# EAGLE schematic RPi Controller (EAGLE 6.5.0)
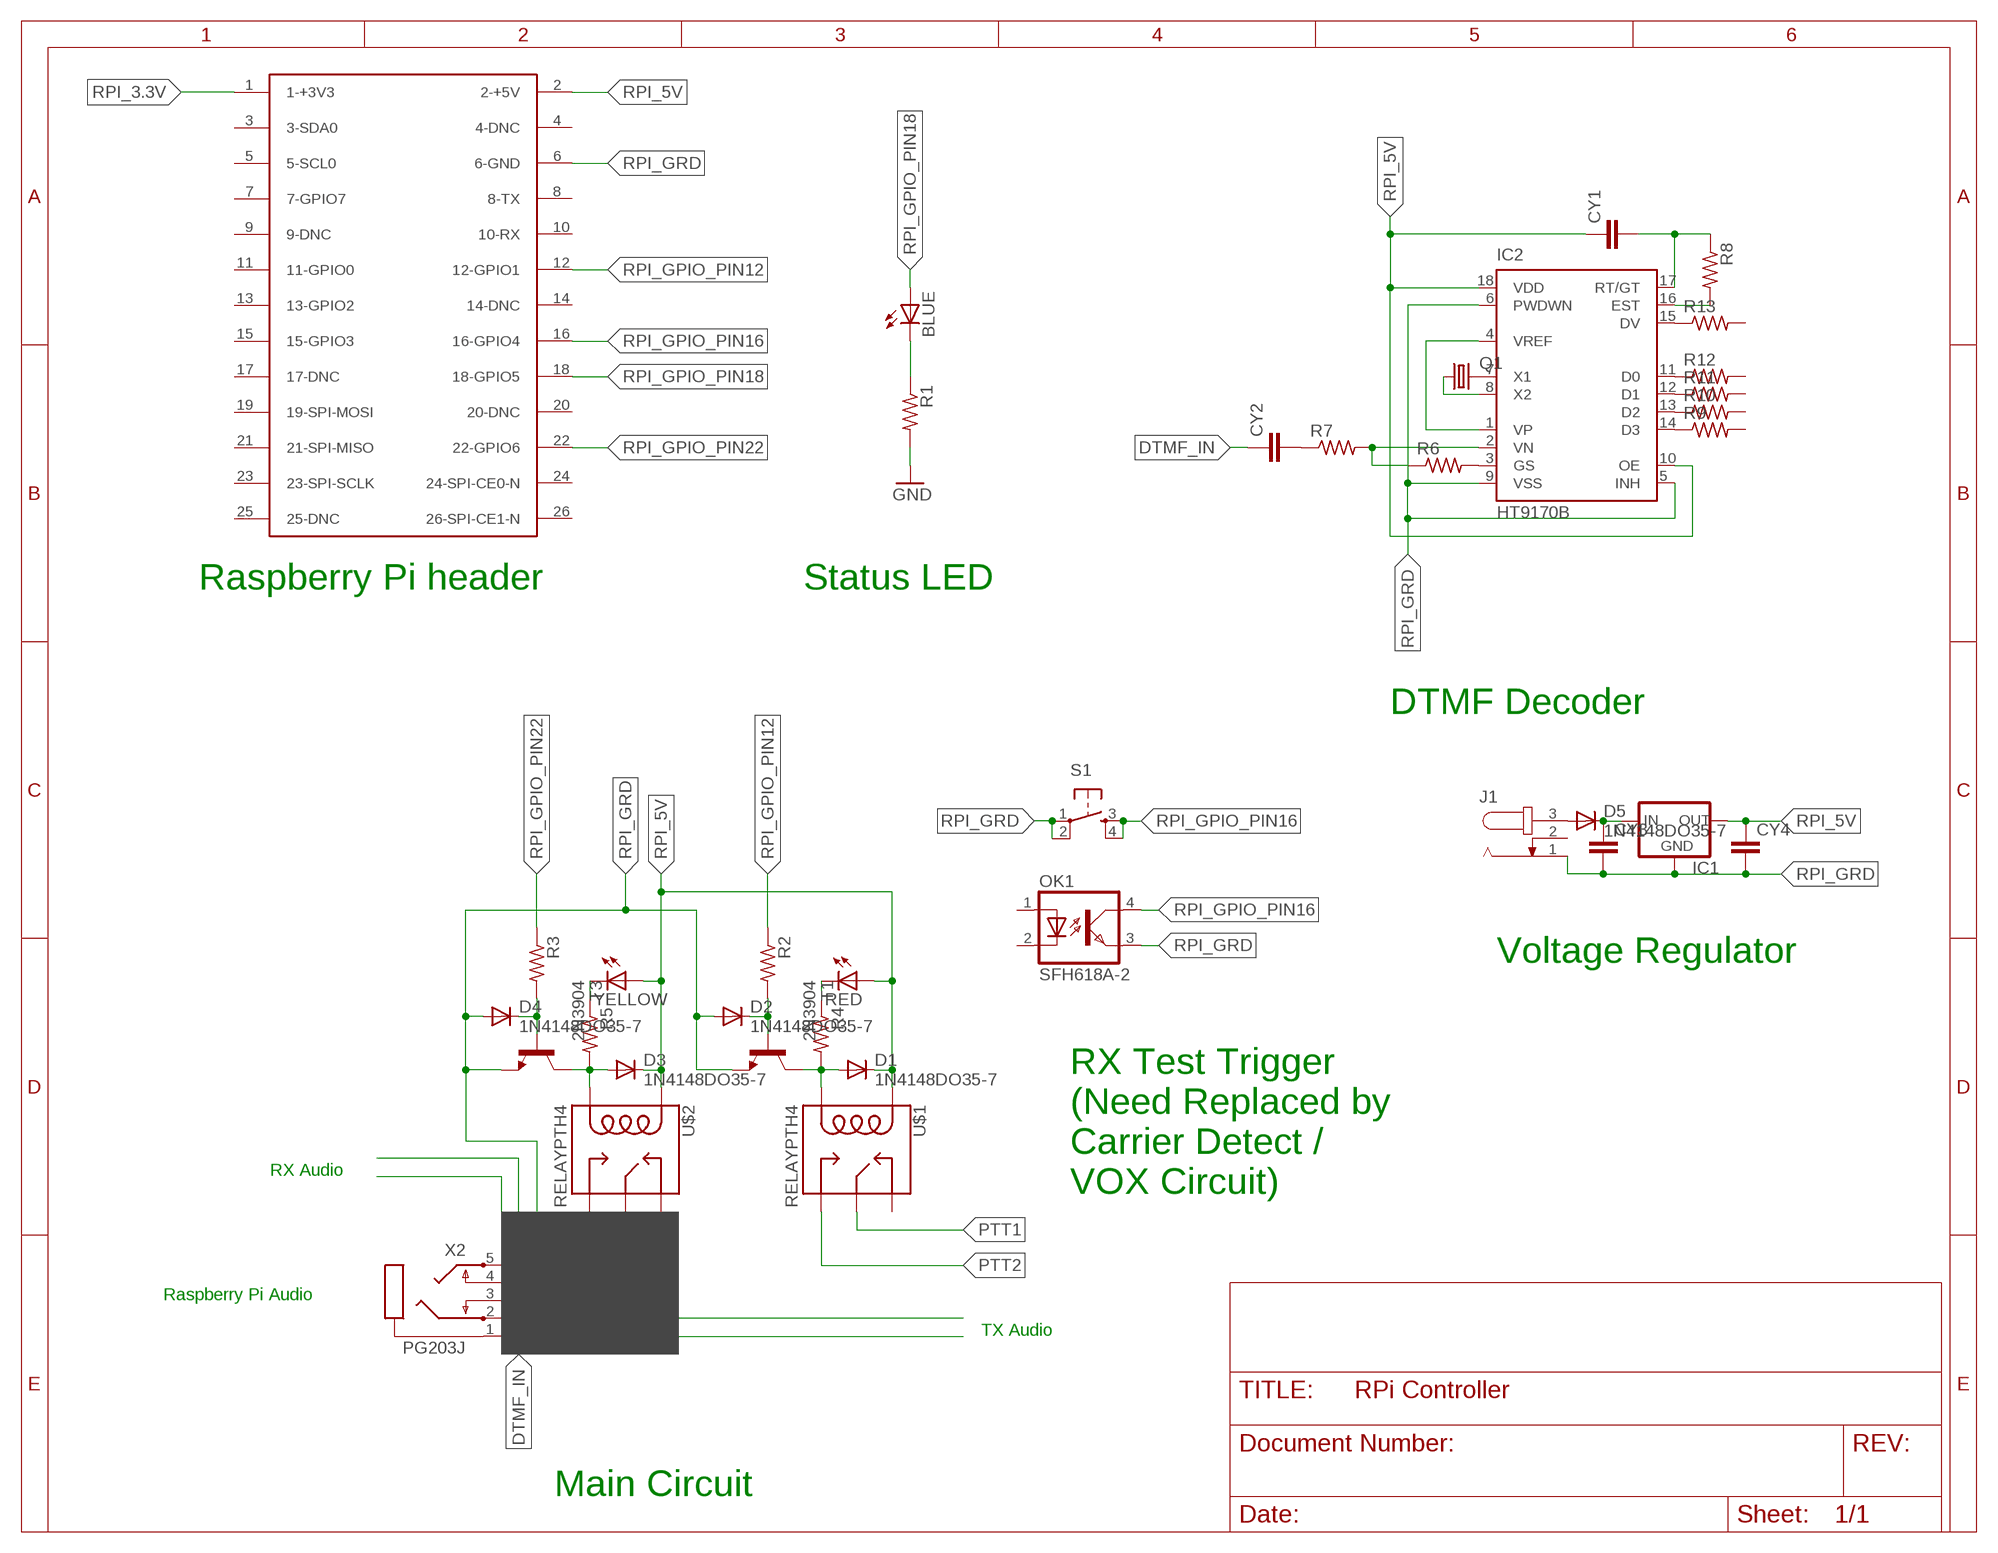
[diagram p0: schematic, sheet 1]

## Parts
BLUE  LED3MM  [LED3MM]
CY1  CYYC7B5  [YC7B5]
CY2  CYYC7B5  [YC7B5]
CY3  CYYC7B5  [YC7B5]
CY4  CYYC7B5  [YC7B5]
D1  1N4148DO35-7  [DO35-7]
D2  1N4148DO35-7  [DO35-7]
D3  1N4148DO35-7  [DO35-7]
D4  1N4148DO35-7  [DO35-7]
D5  1N4148DO35-7  [DO35-7]
IC1  V_REG_78XX-TO-220  [TO-220-ALT]
IC2  HT9170B  [DIL18]
J1  JACK-PLUG0  [SPC4077]
OK1  SFH618A-2  [DIP4]
Q1  CRYSTALHC49U-V  [HC49U-V]
R1  R-US_0204/7  [0204/7]
R2  R-US_0204/7  [0204/7]
R3  R-US_0204/7  [0204/7]
R4  R-US_0204/7  [0204/7]
R5  R-US_0204/7  [0204/7]
R6  R-US_0204/7  [0204/7]
R7  R-US_0204/7  [0204/7]
R8  R-US_0204/7  [0204/7]
R9  R-US_0204/7  [0204/7]
R10  R-US_0204/7  [0204/7]
R11  R-US_0204/7  [0204/7]
R12  R-US_0204/7  [0204/7]
R13  R-US_0204/7  [0204/7]
RED  LED3MM  [LED3MM]
S1  TAC_SWITCHPTH  [TACTILE-PTH]
T1  2N3904  [TO92]
T3  2N3904  [TO92]
U$1  RELAYPTH4  [RELAY-JZC]
U$2  RELAYPTH4  [RELAY-JZC]
X1  P1A  RASPBERRY-PIHEADER  [RASPBERRY-PI-HEADER]
X2  PG203J  [PG203J]
YELLOW  LED3MM  [LED3MM]

## Nets
DTMF_IN: CY2.1 U$2.4(MAIN)
GND: R1.2
N$1: BLUE.K(C) R1.1
N$2: R4.1 RED.K(C)
N$3: U$2.2(NC) X2.5
N$4: D2.C R2.2 T1.2(B)
N$5: D1.A R4.2 T1.1(C) U$1.1(COIL2)
N$6: R5.1 YELLOW.K(C)
N$7: IC2.7(X1) Q1.2
N$8: D4.C R3.2 T3.2(B)
N$9: D3.A R5.2 T3.1(C) U$2.1(COIL2)
N$10: IC2.8(X2) Q1.1
N$11: IC2.14(D3) R9.1
N$12: IC2.2(VN) R6.1 R7.2
N$13: IC2.13(D2) R10.1
N$15: IC2.3(GS) R6.2
N$16: IC2.1(VP) IC2.4(VREF)
N$17: IC2.12(D1) R11.1
N$18: IC2.11(D0) R12.1
N$19: IC2.15(DV) R13.1
N$22: CY3.1 D5.C IC1.IN
N$23: IC2.16(EST) R8.2
N$24: CY1.2 IC2.17(RT/GT) R8.1
N$25: CY2.2 R7.1
N$26: D5.A J1.3
PTT1: U$1.4(MAIN)
PTT2: U$1.3(NO)
RPI_3.3V: X1.1(1-+3V3)
RPI_5V: CY1.1 CY4.1 D1.C D3.C IC1.OUT IC2.10(OE) IC2.18(VDD) RED.A U$1.5(COIL1) U$2.5(COIL1) X1.2(2-+5V) YELLOW.A
RPI_GPIO_PIN12: R2.1 X1.12(12-GPIO1)
RPI_GPIO_PIN16: OK1.4(COL) S1.3 S1.4 X1.16(16-GPIO4)
RPI_GPIO_PIN18: BLUE.A X1.18(18-GPIO5)
RPI_GPIO_PIN22: R3.1 X1.22(22-GPIO6)
RPI_GRD: CY3.2 CY4.2 D2.A D4.A IC1.GND IC2.5(INH) IC2.6(PWDWN) IC2.9(VSS) J1.1 OK1.3(EMIT) S1.1 S1.2 T1.3(E) T3.3(E) X1.6(6-GND) X2.1
Unconnected: J1.2 OK1.1(A) OK1.2(C) R9.2 R10.2 R11.2 R12.2 R13.2 U$1.2(NC) U$2.3(NO) X1.3(3-SDA0) X1.4(4-DNC) X1.5(5-SCL0) X1.7(7-GPIO7) X1.8(8-TX) X1.9(9-DNC) X1.10(10-RX) X1.11(11-GPIO0) X1.13(13-GPIO2) X1.14(14-DNC) X1.15(15-GPIO3) X1.17(17-DNC) X1.19(19-SPI-MOSI) X1.20(20-DNC) X1.21(21-SPI-MISO) X1.23(23-SPI-SCLK) X1.24(24-SPI-CE0-N) X1.25(25-DNC) X1.26(26-SPI-CE1-N) X2.2 X2.3 X2.4

## Notes on the sheet
- Raspberry Pi header | Status LED
- DTMF Decoder
- Voltage Regulator
- RX Audio
- RX Test Trigger
  (Need Replaced by
  Carrier Detect /
  VOX Circuit)
- Raspberry Pi Audio
- TX Audio
- Main Circuit

## Library data of the parts
BLUE RED YELLOW = led:LED: LED OSRAM: - CHIPLED LG R971, LG N971, LY N971, LG Q971, LY Q971, LO R971, LY R971 LH N974, LH R974 LS Q976, LO Q976, LY Q976 LO Q996 - Hyper CHIPLED LW Q18S LB Q993, LB Q99A, LB R99A - SideLED LS A670, LO A670, LY A670, LG A670, LP A670 LB A673, LV A673, LT A673, LW A673 LH A674 LY A675 LS A676, LA A676, LO A676, LY A676, LW A676 LS A679, LY A679, LG A679 - Hyper Micro SIDELED® LS Y876, LA Y876, LO Y876, LY Y876 LT Y87S - SmartLED LW L88C, LW L88S LB L89C, LB L89S, LG L890 LS L89K, LO L89K, LY L89K LS L896, LA L896, LO L896, LY L896 - TOPLED LS T670, LO T670, LY T670, LG T670, LP T670 LSG T670, LSP T670, LSY T670, LOP T670, LYG T670 LG T671, LOG T671, LSG T671 LB T673, LV T673, LT T673, LW T673 LH T674 LS T676, LA T676, LO T676, LY T676, LB T676, LH T676, LSB T676, LW T676 LB T67C, LV T67C, LT T67C, LS T67K, LO T67K, LY T67K, LW E67C LS E67B, LA E67B, LO E67B, LY E67B, LB E67C, LV E67C, LT E67C LW T67C LS T679, LY T679, LG T679 LS T770, LO T770, LY T770, LG T770, LP T770 LB T773, LV T773, LT T773, LW T773 LH T774 LS E675, LA E675, LY E675, LS T675 LS T776, LA T776, LO T776, LY T776, LB T776 LHGB T686 LT T68C, LB T68C - Hyper Mini TOPLED® LB M676 - Mini TOPLED Santana® LG M470 LS M47K, LO M47K, LY M47K Source: http://www.osram.convergy.de LUXEON: - LUMILED® LXK2-PW12-R00, LXK2-PW12-S00, LXK2-PW14-U00, LXK2-PW14-V00 LXK2-PM12-R00, LXK2-PM12-S00, LXK2-PM14-U00 LXK2-PE12-Q00, LXK2-PE12-R00, LXK2-PE12-S00, LXK2-PE14-T00, LXK2-PE14-U00 LXK2-PB12-K00, LXK2-PB12-L00, LXK2-PB12-M00, LXK2-PB14-N00, LXK2-PB14-P00, LXK2-PB14-Q00 LXK2-PR12-L00, LXK2-PR12-M00, LXK2-PR14-Q00, LXK2-PR14-R00 LXK2-PD12-Q00, LXK2-PD12-R00, LXK2-PD12-S00 LXK2-PH12-R00, LXK2-PH12-S00 LXK2-PL12-P00, LXK2-PL12-Q00, LXK2-PL12-R00 Source: www.luxeon.com KINGBRIGHT: KA-3528ASYC Source: www.kingbright.com
CY1-CY4 = rcl:CY: Y CAPACITOR for power line
D1-D5 = diode:1N4148: DIODE high speed (Philips)
IC1 = SparkFun-PowerIC:V_REG_78XX: Voltage Regulator Standard 7805 5V regulator. IGO (Input Ground Output). Spark Fun Electronics SKU : COM-00107
IC2 = holtek:HT9170: DTMF Receiver Source: http://www.holtek.com/pdf/comm/9170v111.pdf; OC_FARNELL: unknown; OC_NEWARK: unknown
J1 = con-jack:JACK-PLUG: DC POWER JACK Power Jack, DC, Right Angle, Through Hole, Rated 5A at 16VDC, PC Terminals Distributor: Farnell (www.Farnell.de) Drawing: 84N1161.pdf / 84N1162.pdf Manufacturer: SPC Technology (www.spctechnology.com) Type: SPC4077 / SPC 4078; OC_FARNELL: unknown; OC_NEWARK: unknown
OK1 = optocoupler:SFH618?*: Optocoupler, Phototransistor Output, Low Input Current Source: Data sheet <http://www.vishay.com/docs/83673/sfh618.pdf>; MF: VISHAY/TELEFUNKEN; MPN: SFH618A-2; OC_FARNELL: 6424855; OC_NEWARK: 21H7744
Q1 = crystal:CRYSTAL: CRYSTAL; OC_FARNELL: 1666969; OC_NEWARK: unknown
R1-R13 = resistor:R-US_: RESISTOR, American symbol
S1 = SparkFun-Electromechanical:TAC_SWITCH: Momentary Switch Button commonly used for reset or general input. Spark Fun Electronics SKU : COM-00097 SMT- SWCH-08247
T1 T3 = transistor:2N3904: NPN TRANSISTOR
U$1 U$2 = SparkFun-Electromechanical:RELAY: SPDT relay (COM-00101)
X1 = SteveMarple:RASPBERRY-PI: Raspberry Pi Board <http://www.raspberrypi.org/> Jacques Lagnel V1.0 (beta) 2012 Board dimension: Forum 3D model <http://www.raspberrypi.org/forum/general-discussion/mechanical-profile-3d-models?value=3d%20model&type=1&include=1&search=1&ret=all> The GPIO Connector (P1): http://elinux.org/RPi_Low-level_peripherals
X2 = con-hirschmann:PG203J: MIC/HEADPHONE JACK KS-S stereo microphone/headphone jack PG203JN (Schukat); OC_FARNELL: unknown; OC_NEWARK: unknown

## Net classes
1 power: width 0.381 mm
2 5V: width 0.381 mm
3 antenna: width 0.61 mm